# Altium project 175-00024, rev1, Backplane, Instrument Crate.PrjPCB
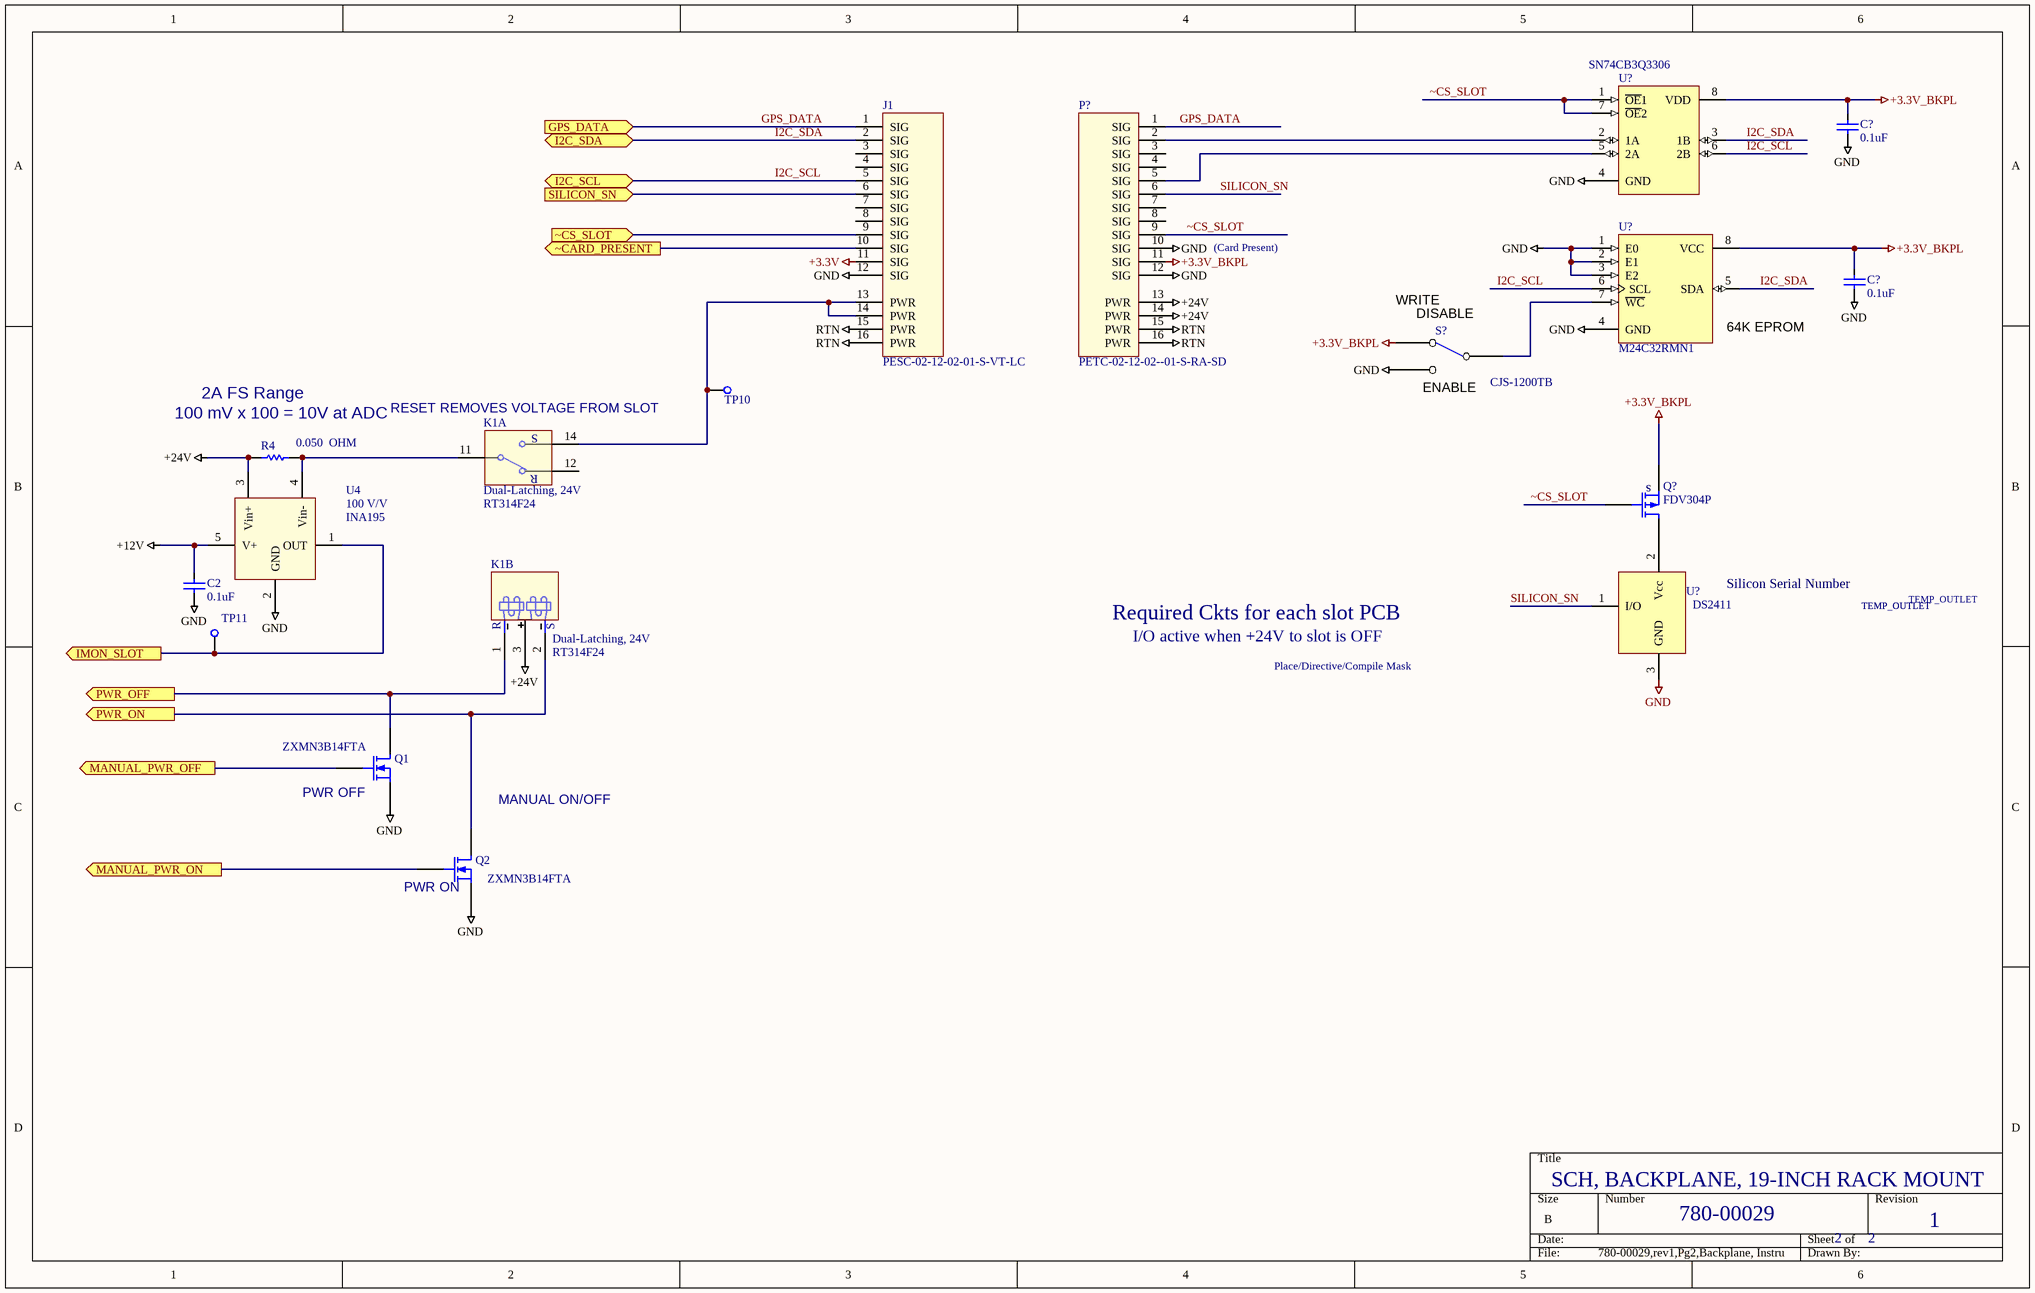
[diagram p0: 780-00029,rev1,Pg2,Backplane, Instrument Crate.SchDoc]
1 sheet, 17 parts. Net scope: flat (ports and power ports of the same name join across sheets).
Board file: 175-00024_rev1, Backplane, Instrument Crate.PcbDoc

## Sheet 780-00029,rev1,Pg2,Backplane, Instrument Crate.SchDoc
size B; PageSetup: Record=PageOptions|CenterHorizontal=True|CenterVertical=True|PrintScale=1.09|XCorrection=1.00|YCorrection=1.00|PrintKind=0|BorderSize=5000000|LeftOffset=0|BottomOffset=0|Orientation=2|PaperLength=1000|PaperWidth=1000|Scale=100|PaperSource=7|PrintQuality=-4|MediaType=1|DitherType=10|PaperKind=Tabloid 11 x 17in|PrintScaleMode=1

### Parts
(Parts that share a designator on the sheet are numbered #1, #2 ... from top to bottom, then left to right.)
C2  value 0.1uF  [SMD_0805]  (hidden comment: Cap SMD)
C?#1  value 0.1uF  [SMD_0805]  (hidden comment: Cap SMD)
C?#2  value 0.1uF  [SMD_0805]  (hidden comment: Cap SMD)
J1  PESC-02-12-02-01-S-VT-LC  [PESC-02-12-02-01-S-VT-LC]
K1  Dual-Latching, 24V  value RT314F24  [RELAY, TYCO RT1]  (parts A,B of 2)
P?  PETC-02-12-02--01-S-RA-SD  [PETC-02-12-02-01-RA]
Q1  ZXMN3B14FTA  [SOT-23B]
Q2  ZXMN3B14FTA  [SOT-23B]
Q?  FDV304P  [SMD_SOT23_3]
R4  value 0.050  OHM  [SMD_0805]  (hidden comment: Res 0805)
S?  CJS-1200TB  [CAS-120B]
TP10  Test point  [PAD_80D_052H]  (value not drawn)
TP11  Test point  [PAD_80D_052H]  (value not drawn)
U4  100 V/V  value INA195  [SMD_SOT23_5]
U?#1  value SN74CB3Q3306  [PW008_N]  (hidden comment: SN74CBT3306PWLE)
U?#2  M24C32RMN1  [SOP8_N]
U?#3  DS2411  [SMD_SOT23_3]

### Ports
GPS_DATA (in), I2C_SCL, I2C_SDA, IMON_SLOT (out), MANUAL_PWR_OFF (out), MANUAL_PWR_ON (out), PWR_OFF (out), PWR_ON (out), SILICON_SN (in), ~CARD_PRESENT (out), ~CS_SLOT (in)

### Nets
+3.3V: J1.11(SIG)
+3.3V_BKPL: C?#1.2 C?#2.2 P?.11(SIG) Q?.2(S) S?.3(NC) U?#1.8(VDD) U?#2.8(VCC)
+12V: C2.2 U4.5(V+)
+24V: K1.3(Com) P?.13(PWR) P?.14(PWR) R4.1 U4.3(Vin+)
GND: C2.1 C?#1.1 C?#2.1 J1.12(SIG) P?.10(SIG) P?.12(SIG) Q1.3(S) Q2.3(S) S?.1(NO) U4.2(GND) U?#1.4(GND) U?#2.1(E0) U?#2.2(E1) U?#2.3(E2) U?#2.4(GND) U?#3.3(GND)
RTN: J1.15(PWR) J1.16(PWR) P?.15(PWR) P?.16(PWR)
GPS_DATA: J1.1(SIG) P?.1(SIG) ; port GPS_DATA
I2C_SCL: J1.5(SIG) U?#1.6(2B) U?#2.6(SCL) ; port I2C_SCL
I2C_SDA: J1.2(SIG) U?#1.3(1B) U?#2.5(SDA) ; port I2C_SDA
SILICON_SN: P?.6(SIG) U?#3.1(I/O)
~CS_SLOT: P?.9(SIG) Q?.1(G) U?#1.1(~{OE}1) U?#1.7(~{OE}2)
NetJ1_6: J1.6(SIG) ; port SILICON_SN
NetJ1_9: J1.9(SIG) ; port ~CS_SLOT
NetJ1_10: J1.10(SIG) ; port ~CARD_PRESENT
NetJ1_13: J1.13(PWR) J1.14(PWR) K1.14(S) TP10.1(TP)
NetK1_1: K1.1(Reset) Q1.1(D) ; port PWR_OFF
NetK1_2: K1.2(Reset) Q2.1(D) ; port PWR_ON
NetK1_11: K1.11(Wiper) R4.2 U4.4(Vin-)
NetP?_2: P?.2(SIG) U?#1.2(1A)
NetP?_5: P?.5(SIG) U?#1.5(2A)
NetQ1_2: Q1.2(G) ; port MANUAL_PWR_OFF
NetQ2_2: Q2.2(G) ; port MANUAL_PWR_ON
NetQ?_3: Q?.3(D) U?#3.2(Vcc)
NetS?_2: S?.2(COM) U?#2.7(~{WC})
NetTP11_1: TP11.1(TP) U4.1(OUT) ; port IMON_SLOT

Not connected (* = marked no-connect by the designer): J1 3(SIG) 4(SIG) 7(SIG) 8(SIG); K1 12(R); P? 3(SIG) 4(SIG) 7(SIG) 8(SIG)

### Notes on the sheet
- (Card Present)
- (near S?) WRITE
- (near S?) DISABLE
- (near U?#2) 64K EPROM
- (near R4) 100 mV x 100 = 10V at ADC
- 2A FS Range
- (near K1) RESET REMOVES VOLTAGE FROM SLOT
- (near S?) ENABLE
- Required Ckts for each slot PCB
- I/O active when +24V to slot is OFF
- Silicon Serial Number
- TEMP_OUTLET
- Place/Directive/Compile Mask
- (near Q1) PWR OFF
- MANUAL ON/OFF
- (near Q2) PWR ON
- SCH, BACKPLANE, 19-INCH RACK MOUNT
- 780-00029
- 2
- 1
- (in symbol FDV304P) s

### Library data of the parts
C2 = Cap SMD: Capacitor; LCO p/n: 120-00002
C?#1 C?#2 = Cap SMD: Capacitor; Manufacturer: AVX; Manuf p/n: 08055C104KAT2A; Vendor: DigiKey; Vendor p/n: 478-1395-1-ND; Vendor Mult.: 10; Arena Prefix: 120; LCO P/N: 120-00002; COST: 0.088; Arena Type: Capacitor
J1 = PESC-02-12-02-01-S-VT-LC: SAMTEC, SIGNAL(12)+PWR(4), VERT; LCO p/n: 125-00088; Manufacturer: Samtec; Manuf p/n: PESC-02-12-02-01-S-VT-LC; VALUE: PESC-02-12-02-01-S-VT-LC; Vendor: Samtec; Vendor p/n: PESC-02-12-02-01-S-VT-LC
K1 = Relay SPDT, 16A: Tyco/Schrack RT314F24, Dual Latching; Vendor: DigiKey; Vendor Mult.: 1; Vendor p/n: PB1086-ND; LCO p/n: 183-00001; COST: 3.79; Manufacturer: Tyco/Schrack; Manuf p/n: RT314F24
P? = PETC-02-12-02--01-S-RA-SD: SAMTEC, SIGNAL(12)+PWR(4); Vendor Mult.: 1; Manufacturer: SAMTEC; Manuf p/n: PETC-02-12-02--01-S-RA-SD; Vendor: SAMTEC; Vendor p/n: PETC-02-12-02--01-S-RA-SD
Q1 Q2 = MOSFET-N: N-Channel MOSFET; pin to pad: 1>3 2>1 3>2; Manufacturer: ZETEX; Manuf p/n: ZXMN3B01FTA; Value: ZXMN3B01; Vendor: DIGIKEY; Vendor Mult.: 1; Vendor p/n: ZXMN3B01FCT-ND; LCO p/n: 195-00002; COST: 0.69
Q? = FDV304P: P-MOSFET LOGIC LEVEL; Manufacturer: Fairchild; Vendor: DigiKey; Vendor p/n: FDV304PCT-ND; Vendor Mult.: 1; Arena Prefix: 195; Arena Type: Transistor; LCO P/N: 195-00004; COST: 0.46; Manuf p/n: FDV304P; Value: FDV304P
R4 = Res SMD: Resistor 0805; Manufacturer: Vishay/Dale; Manuf p/n: WSL0805R0500FEA18; Vendor: DIGIKEY; Vendor p/n: WSLB-.05CT-ND; Vendor Mult.: 1; LCO p/n: 181-R0500; COST: 1.07
S? = SW_SPDT_DOUG: Manufacturer: Copal Electronics; Manuf p/n: CAS-120TA; Vendor: DIGIKEY; Vendor Mult.: 1; Vendor p/n: CAS120JTR-ND; LCO p/n: 185-00010; COST: 1.27; Value: SW_SPDT
TP10 TP11 = Test point: Manufacturer: Keystone; Manuf p/n: 1249; Vendor: Bisco Ind.; LCO p/n: 125-00013; Vendor p/n: 1249; COST: 0.18; VALUE: Test point
U4 = INA195: Current Shunt Monitor; Manufacturer: TI; Manuf p/n: INA195AIDBVR; LCO p/n: 150-00100; Vendor: Digi-Key; Vendor Mult.: 1; Vendor p/n: 296-26067-1-ND; COST: 2.80
U?#1 = SN74CBT3306PWLE: Dual FET Bus Switch; Manufacturer: TI; Manuf p/n: SN74CB3Q3306APWR; LCO p/n: 150-00083; Vendor: Digi-Key; Vendor Mult.: 1; Vendor p/n: 296-15102-1-ND; COST: 0.95
U?#2 = M24C32RMN1: 32 Kbit Serial I²C Bus EEPROM; LCO p/n: 150-00076
U?#3 = DS2411: Silicon Serial Number; Manufacturer: Dallas; Manuf p/n: DS2411P+; Vendor: DigiKey; Vendor p/n: DS2411P+-ND; Vendor Mult.: 1; Arena Prefix: 150; Arena Type: IC; LCO P/N: 150-00030; COST: 1.59; Value: DS2411